# EAGLE schematic Battery manage (EAGLE 7.6.0)
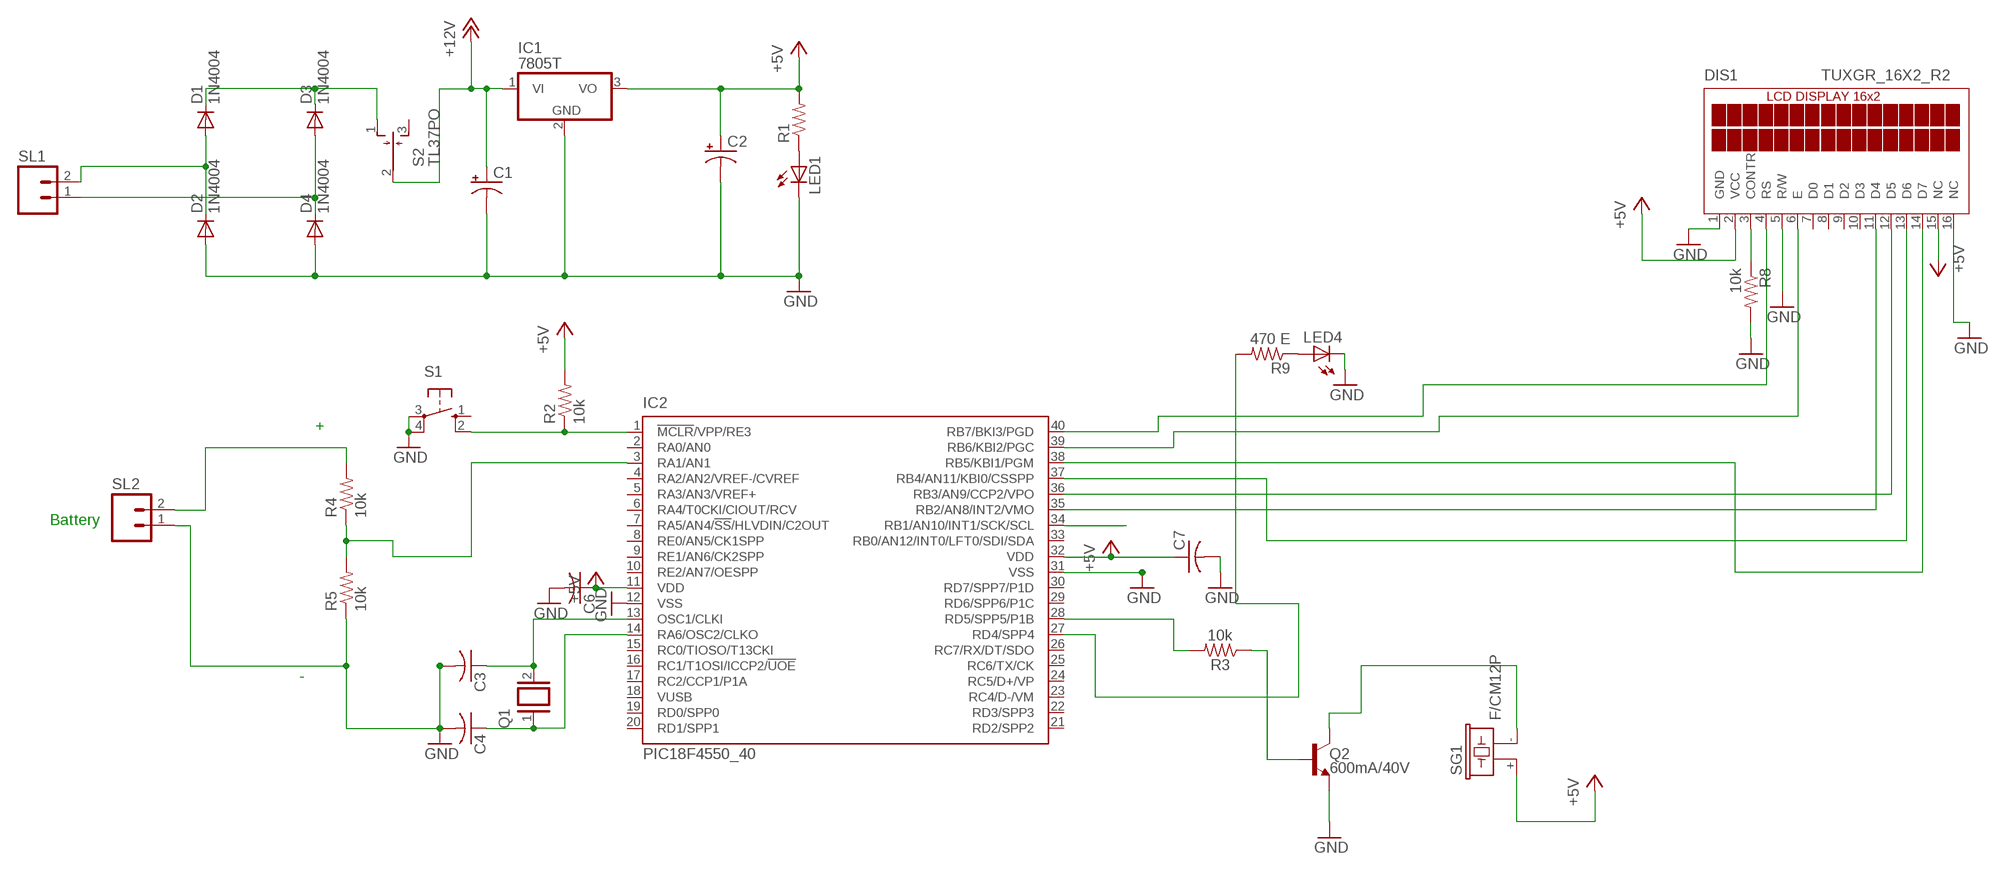
[diagram p0: schematic, sheet 1]

## Parts
C1  CPOL-USE3.5-8  [E3,5-8]
C2  CPOL-USE3.5-8  [E3,5-8]
C3  C-US025-024X044  [C025-024X044]
C4  C-US025-024X044  [C025-024X044]
C6  C-US025-024X044  [C025-024X044]
C7  C-US025-024X044  [C025-024X044]
D1  1N4004  [DO41-10]
D2  1N4004  [DO41-10]
D3  1N4004  [DO41-10]
D4  1N4004  [DO41-10]
DIS1  TUXGR_16X2_R2  [TUXGR_16X2_R2]
IC1  7805T  [TO220H]
IC2  PIC18F4550_40  [DIL40]
LED1  LED5MM  [LED5MM]
LED4  LED5MM  [LED5MM]
Q1  XTAL/S  [QS]
Q2  600mA/40V  TRANS_NPN-P2N2222A  [TO-92]
R1  R-US_0207/10  [0207/10]
R2  10k  R-US_0207/10  [0207/10]
R3  10k  10KOHM-HORIZ-1/4W-1%  [AXIAL-0.3]
R4  10k  R-US_0207/10  [0207/10]
R5  10k  R-US_0207/10  [0207/10]
R8  10k  R-US_0207/10  [0207/10]
R9  470 E  R-US_0207/10  [0207/10]
S1  10-XX  [B3F-10XX]
S2  TL37PO  [TL3XPO]
SG1  F/CM12P  [F/CM12P]
SL1  MA02  [02PA]
SL2  MA02  [02PA]

## Nets
+5V: C2.+ C6.1 C7.1 DIS1.2(VCC) DIS1.15(NC) IC1.3(VO) IC2.11(VDD) IC2.32(VDD) R1.2 R2.2 SG1.+
+12V: C1.+ IC1.1(VI) S2.2(P)
GND: C1.- C2.- C3.2 C4.2 C6.2 C7.2 D2.A D4.A DIS1.1(GND) DIS1.5(R/W) DIS1.16(NC) IC1.2(GND) IC2.12(VSS) IC2.31(VSS) LED1.K(C) LED4.K(C) Q2.3(E) R5.1 R8.2 S1.3(P) S1.4(P1) SL2.1
N$2: D1.A D2.C SL1.2
N$3: D3.A D4.C SL1.1
N$5: IC2.34(RB1/AN10/INT1/SCK/SCL)
N$6: LED1.A R1.1
N$8: DIS1.11(D4) IC2.35(RB2/AN8/INT2/VMO)
N$9: R4.2 SL2.2
N$10: IC2.28(RD5/SPP5/P1B) R3.P$2
N$11: IC2.1(!MCLR!/VPP/RE3) R2.1 S1.2(S1)
N$12: Q2.2(B) R3.P$1
N$13: DIS1.4(RS) IC2.40(RB7/BKI3/PGD)
N$14: DIS1.6(E) IC2.39(RB6/KBI2/PGC)
N$15: Q2.1(C) SG1.-
N$16: IC2.27(RD4/SPP4) R9.2
N$17: LED4.A R9.1
N$18: IC2.3(RA1/AN1) R4.1 R5.2
N$24: C4.1 IC2.14(RA6/OSC2/CLKO) Q1.1
N$25: C3.1 IC2.13(OSC1/CLKI) Q1.2
N$26: DIS1.14(D7) IC2.38(RB5/KBI1/PGM)
N$27: DIS1.13(D6) IC2.37(RB4/AN11/KBI0/CSSPP)
N$28: DIS1.12(D5) IC2.36(RB3/AN9/CCP2/VPO)
N$30: DIS1.3(CONTR) R8.1
N$114: D1.C D3.C S2.1(O)
Unconnected: DIS1.7(D0) DIS1.8(D1) DIS1.9(D2) DIS1.10(D3) IC2.2(RA0/AN0) IC2.4(RA2/AN2/VREF-/CVREF) IC2.5(RA3/AN3/VREF+) IC2.6(RA4/T0CKI/CIOUT/RCV) IC2.7(RA5/AN4/!SS!/HLVDIN/C2OUT) IC2.8(RE0/AN5/CK1SPP) IC2.9(RE1/AN6/CK2SPP) IC2.10(RE2/AN7/OESPP) IC2.15(RC0/TIOSO/T13CKI) IC2.16(RC1/T1OSI/ICCP2/!UOE) IC2.17(RC2/CCP1/P1A) IC2.18(VUSB) IC2.19(RD0/SPP0) IC2.20(RD1/SPP1) IC2.21(RD2/SPP2) IC2.22(RD3/SPP3) IC2.23(RC4/D-/VM) IC2.24(RC5/D+/VP) IC2.25(RC6/TX/CK) IC2.26(RC7/RX/DT/SDO) IC2.29(RD6/SPP6/P1C) IC2.30(RD7/SPP7/P1D) IC2.33(RB0/AN12/INT0/LFT0/SDI/SDA) S1.1(S) S2.3(S)

## Notes on the sheet
- +
- Battery
- -

## Library data of the parts
C1 C2 = adafruit:CPOL-US: POLARIZED CAPACITOR, American symbol
C3 C4 C6 C7 = adafruit:C-US: CAPACITOR, American symbol
D1-D4 = diode:1N4004: DIODE general purpose rectifier, 1 A
DIS1 = display-lcd:TUXGR_16X2_R2: Tuxgraphics LCD display 16x2 characters reflective, without background light Source: tuxgr_12x2_r2.pdf; OC_FARNELL: unknown; OC_NEWARK: unknown
IC1 = adafruit:78*: Positive VOLTAGE REGULATOR Added bigger pads to the TO-92 package
IC2 = microchip:PIC18F4*_40: USB Microcontrollers with nanoWatt Technology High-Performance, Enhanced Flash, 28/40/44-Pin, Source: http://ww1.microchip.com/downloads/en/devicedoc/39632c.pdf; MF: MICROCHIP; MPN: PIC18F4550-I/P; OC_FARNELL: 9321357; OC_NEWARK: 74K8623
LED1 LED4 = adafruit:LED: LED OSRAM: - CHIPLED LG R971, LG N971, LY N971, LG Q971, LY Q971, LO R971, LY R971 LH N974, LH R974 LS Q976, LO Q976, LY Q976 LO Q996 - Hyper CHIPLED LW Q18S LB Q993, LB Q99A, LB R99A - SideLED LS A670, LO A670, LY A670, LG A670, LP A670 LB A673, LV A673, LT A673, LW A673 LH A674 LY A675 LS A676, LA A676, LO A676, LY A676, LW A676 LS A679, LY A679, LG A679 - Hyper Micro SIDELED® LS Y876, LA Y876, LO Y876, LY Y876 LT Y87S - SmartLED LW L88C, LW L88S LB L89C, LB L89S, LG L890 LS L89K, LO L89K, LY L89K LS L896, LA L896, LO L896, LY L896 - TOPLED LS T670, LO T670, LY T670, LG T670, LP T670 LSG T670, LSP T670, LSY T670, LOP T670, LYG T670 LG T671, LOG T671, LSG T671 LB T673, LV T673, LT T673, LW T673 LH T674 LS T676, LA T676, LO T676, LY T676, LB T676, LH T676, LSB T676, LW T676 LB T67C, LV T67C, LT T67C, LS T67K, LO T67K, LY T67K, LW E67C LS E67B, LA E67B, LO E67B, LY E67B, LB E67C, LV E67C, LT E67C LW T67C LS T679, LY T679, LG T679 LS T770, LO T770, LY T770, LG T770, LP T770 LB T773, LV T773, LT T773, LW T773 LH T774 LS E675, LA E675, LY E675, LS T675 LS T776, LA T776, LO T776, LY T776, LB T776 LHGB T686 LT T68C, LB T68C - Hyper Mini TOPLED® LB M676 - Mini TOPLED Santana® LG M470 LS M47K, LO M47K, LY M47K Source: http://www.osram.convergy.de/
Q1 = special:XTAL/S: CRYSTAL
Q2 = SparkFun-DiscreteSemi:TRANS_NPN: NPN transistor Current controlled devices typically used to amplify current or used as a switch. BC547 - COM-08928 <http://www.sparkfun.com/products/8928> (TO-92 45V 100mA) (1.Collector 2.Base 3.Emitter) 2N3904 - COM-00521 <http://www.sparkfun.com/products/521> (TO-92 40V 200mA) (1.Emitter 2.Base 3.Collector) P2N2222A - COM-12852 <http://www.sparkfun.com/products/12852> (TO-92 40V 600mA) (1.Collector 2.Base 3.Emitter); PROD_ID: TRANS-09536
R1 R2 R4 R5 R8 R9 = adafruit:R-US_: RESISTOR, American symbol
R3 = SparkFun-Resistors:10KOHM: 10kΩ resistor A resistor is a passive two-terminal electrical component that implements electrical resistance as a circuit element. Resistors act to reduce current flow, and, at the same time, act to lower voltage levels within circuits. - Wikipedia; PROD_ID: RES-12183
S1 = switch-omron:10-XX: OMRON SWITCH; MPN: B3F-1000; OC_FARNELL: 176432; OC_NEWARK: 36M3542
S2 = switch:TL37PO: TINY SWITCH MOM OFF MOM Source: http://www2.produktinfo.conrad.com/datenblaetter/700000-724999/705152-da-01-de-Subminiaturschalter_TL_36YO.pdf
SG1 = buzzer:F/CM12P: BUZZER Source: Buerklin; OC_FARNELL: unknown; OC_NEWARK: unknown
SL1 SL2 = con-amp-quick:MA02: AMP QUICK CONNECTOR; OC_FARNELL: unknown; OC_NEWARK: unknown